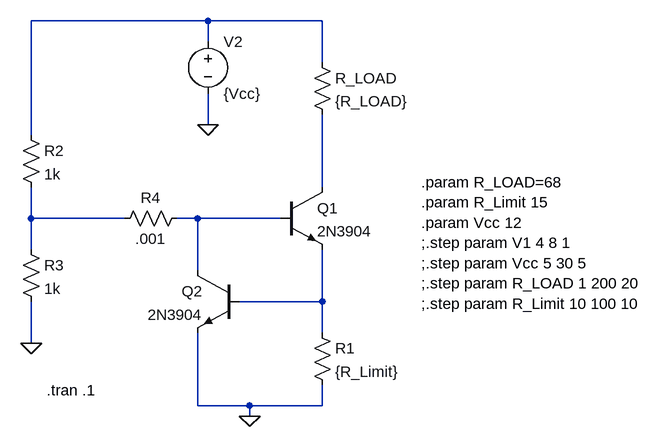
[diagram p0: schematic CurrentLimiting-2-Transistors1.asc]
CurrentLimiting-2-Transistors1.asc, the LTspice schematic file:
Version 4
SHEET 1 952 680
WIRE 256 -288 -16 -288
WIRE 432 -288 256 -288
WIRE 256 -256 256 -288
WIRE 432 -224 432 -288
WIRE 256 -128 256 -176
WIRE -16 -112 -16 -288
WIRE 432 -32 432 -144
WIRE -16 16 -16 -32
WIRE 128 16 -16 16
WIRE 240 16 208 16
WIRE 368 16 240 16
WIRE -16 64 -16 16
WIRE 240 96 240 16
WIRE 432 144 432 64
WIRE 432 144 304 144
WIRE 432 192 432 144
WIRE -16 208 -16 144
WIRE 240 304 240 192
WIRE 320 304 240 304
WIRE 432 304 432 272
WIRE 432 304 320 304
WIRE 320 320 320 304
FLAG 320 320 0
FLAG 256 -128 0
FLAG -16 208 0
SYMBOL voltage 256 -272 R0
WINDOW 123 0 0 Left 0
WINDOW 39 0 0 Left 0
SYMATTR InstName V2
SYMATTR Value {Vcc}
SYMBOL res 416 176 R0
SYMATTR InstName R1
SYMATTR Value {R_Limit}
SYMBOL res -32 -128 R0
SYMATTR InstName R2
SYMATTR Value 1k
SYMBOL npn 368 -32 R0
SYMATTR InstName Q1
SYMATTR Value 2N3904
SYMBOL npn 304 96 M0
SYMATTR InstName Q2
SYMATTR Value 2N3904
SYMBOL res 416 -240 R0
SYMATTR InstName R_LOAD
SYMATTR Value {R_LOAD}
SYMBOL res -32 48 R0
SYMATTR InstName R3
SYMATTR Value 1k
SYMBOL res 224 0 R90
WINDOW 0 0 56 VBottom 2
WINDOW 3 32 56 VTop 2
SYMATTR InstName R4
SYMATTR Value .001
TEXT 8 280 Left 2 !.tran .1
TEXT 584 -40 Left 2 !.param R_LOAD=68\n.param R_Limit 15\n.param Vcc 12\n;.step param V1 4 8 1\n;.step param Vcc 5 30 5\n;.step param R_LOAD 1 200 20\n;.step param R_Limit 10 100 10

The netlist it stands for:
* CurrentLimiting-2-Transistors1.asc
V2 N001 0 {Vcc}
R1 N005 0 {R_Limit}
R2 N001 N003 1k
Q1 N002 N004 N005 0 2N3904
Q2 N004 N005 0 0 2N3904
R_LOAD N001 N002 {R_LOAD}
R3 N003 0 1k
R4 N004 N003 .001
.model NPN NPN
.model PNP PNP
.lib standard.bjt
.tran .1
.param R_LOAD=68
.param R_Limit 15
.param Vcc 12
;.step param V1 4 8 1
;.step param Vcc 5 30 5
;.step param R_LOAD 1 200 20
;.step param R_Limit 10 100 10
.backanno
.end